# Altium schematic sheet SOCEthernetPHY.SchDoc
size A4; SheetNumber: 17; SheetTotal: 18
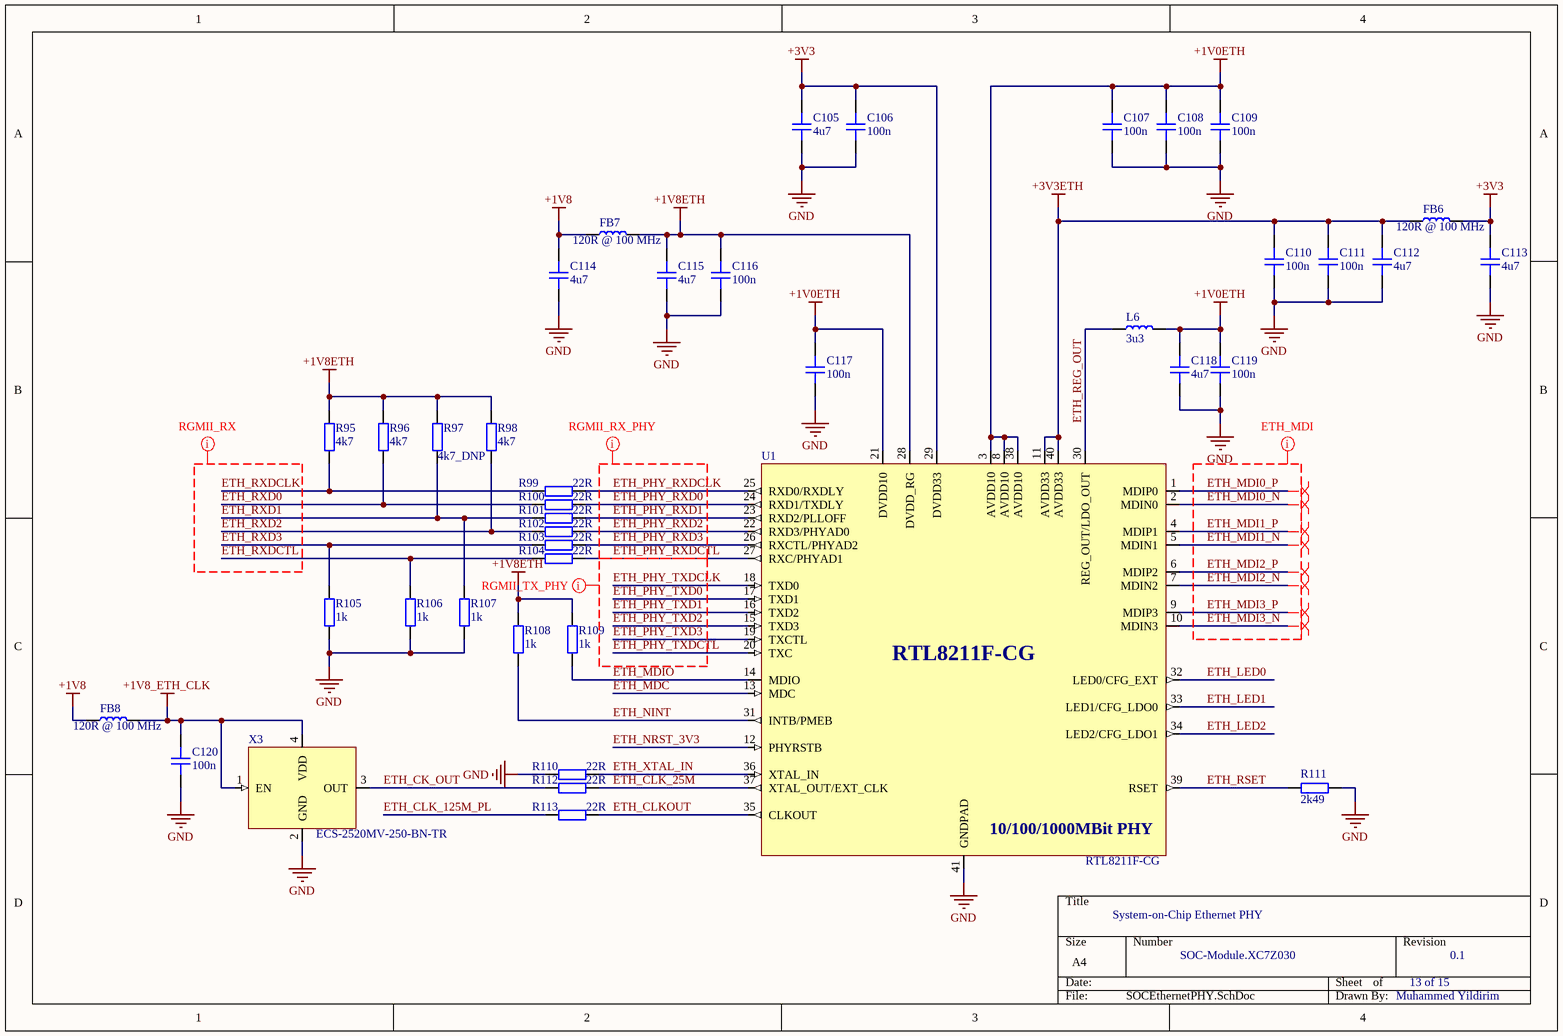
[diagram p0: SOCEthernetPHY.SchDoc]

## Parts
C105  4u7  [CAP_0402]
C106  100n  [CAP_0201]
C107  100n  [CAP_0201]
C108  100n  [CAP_0201]
C109  100n  [CAP_0201]
C110  100n  [CAP_0201]
C111  100n  [CAP_0201]
C112  4u7  [CAP_0402]
C113  4u7  [CAP_0402]
C114  4u7  [CAP_0402]
C115  4u7  [CAP_0402]
C116  100n  [CAP_0201]
C117  100n  [CAP_0201]
C118  4u7  [CAP_0402]
C119  100n  [CAP_0201]
C120  100n  [CAP_0201]
FB6  120R @ 100 MHz  [IND_0201]
FB7  120R @ 100 MHz  [IND_0201]
FB8  120R @ 100 MHz  [IND_0201]
L6  3u3  [IND_0402]
R95  4k7  [RES_0201]
R96  4k7  [RES_0201]
R97  4k7_DNP  [RES_0201]
R98  4k7  [RES_0201]
R99  22R  [RES_0201]
R100  22R  [RES_0201]
R101  22R  [RES_0201]
R102  22R  [RES_0201]
R103  22R  [RES_0201]
R104  22R  [RES_0201]
R105  1k  [RES_0201]
R106  1k  [RES_0201]
R107  1k  [RES_0201]
R108  1k  [RES_0201]
R109  1k  [RES_0201]
R110  22R  [RES_0201]
R111  2k49  [RES_0201]
R112  22R  [RES_0201]
R113  22R  [RES_0201]
U1  RTL8211F-CG  [QFN-40-0.4-EP]
X3  ECS-2520MV-250-BN-TR  [XTAL_2520]

## Nets
+1V0ETH: C107.2 C108.2 C109.2 C117.2 C118.2 C119.1 L6.2 U1.3(AVDD10) U1.8(AVDD10) U1.21(DVDD10) U1.38(AVDD10)
+1V8: C114.2 FB7.1 FB8.1
+1V8_ETH_CLK: C120.1 FB8.2 X3.1(EN) X3.4(VDD)
+1V8ETH: C115.2 C116.2 FB7.2 R95.1 R96.1 R97.1 R98.1 R108.1 R109.1 U1.28(DVDD_RG)
+3V3: C105.2 C106.2 C113.2 FB6.2 U1.29(DVDD33)
+3V3ETH: C110.1 C111.1 C112.2 FB6.1 U1.11(AVDD33) U1.40(AVDD33)
GND: C105.1 C106.1 C107.1 C108.1 C109.1 C110.2 C111.2 C112.1 C113.1 C114.1 C115.1 C116.1 C117.1 C118.1 C119.2 C120.2 R105.2 R106.2 R107.2 R110.1 R111.1 U1.41(GNDPAD) X3.2(GND)
ETH_CK_OUT: R112.1 X3.3(OUT)
ETH_CLK_25M: R112.2 U1.37(XTAL_OUT/EXT_CLK)
ETH_CLK_125M_PL: R113.1
ETH_CLKOUT: R113.2 U1.35(CLKOUT)
ETH_LED0: U1.32(LED0/CFG_EXT)
ETH_LED1: U1.33(LED1/CFG_LDO0)
ETH_LED2: U1.34(LED2/CFG_LDO1)
ETH_MDC: U1.13(MDC)
ETH_MDI0_N: U1.2(MDIN0)
ETH_MDI0_P: U1.1(MDIP0)
ETH_MDI1_N: U1.5(MDIN1)
ETH_MDI1_P: U1.4(MDIP1)
ETH_MDI2_N: U1.7(MDIN2)
ETH_MDI2_P: U1.6(MDIP2)
ETH_MDI3_N: U1.10(MDIN3)
ETH_MDI3_P: U1.9(MDIP3)
ETH_MDIO: R109.2 U1.14(MDIO)
ETH_NINT: R108.2 U1.31(INTB/PMEB)
ETH_NRST_3V3: U1.12(PHYRSTB)
ETH_PHY_RXD0: R100.1 U1.24(RXD1/TXDLY)
ETH_PHY_RXD1: R101.1 U1.23(RXD2/PLLOFF)
ETH_PHY_RXD2: R102.1 U1.22(RXD3/PHYAD0)
ETH_PHY_RXD3: R103.1 U1.26(RXCTL/PHYAD2)
ETH_PHY_RXDCLK: R99.1 U1.25(RXD0/RXDLY)
ETH_PHY_RXDCTL: R104.1 U1.27(RXC/PHYAD1)
ETH_PHY_TXD0: U1.17(TXD1)
ETH_PHY_TXD1: U1.16(TXD2)
ETH_PHY_TXD2: U1.15(TXD3)
ETH_PHY_TXD3: U1.19(TXCTL)
ETH_PHY_TXDCLK: U1.18(TXD0)
ETH_PHY_TXDCTL: U1.20(TXC)
ETH_REG_OUT: L6.1 U1.30(REG_OUT/LDO_OUT)
ETH_RSET: R111.2 U1.39(RSET)
ETH_RXD0: R96.2 R100.2
ETH_RXD1: R97.2 R101.2 R107.1
ETH_RXD2: R98.2 R102.2
ETH_RXD3: R103.2 R105.1
ETH_RXDCLK: R95.2 R99.2
ETH_RXDCTL: R104.2 R106.1
ETH_XTAL_IN: R110.2 U1.36(XTAL_IN)

## Layout directives
differential pair: ETH_MDI0_N, ETH_MDI0_P, ETH_MDI1_N, ETH_MDI1_P, ETH_MDI2_N, ETH_MDI2_P, ETH_MDI3_N, ETH_MDI3_P
mark named ETH_MDI: ETH_MDI0_N, ETH_MDI0_P, ETH_MDI1_N, ETH_MDI1_P, ETH_MDI2_N, ETH_MDI2_P, ETH_MDI3_N, ETH_MDI3_P
mark named RGMII_RX_PHY: ETH_PHY_RXD0, ETH_PHY_RXD1, ETH_PHY_RXD2, ETH_PHY_RXD3, ETH_PHY_RXDCLK, ETH_PHY_RXDCTL
mark named RGMII_RX: ETH_RXD0, ETH_RXD1, ETH_RXD2, ETH_RXD3, ETH_RXDCLK, ETH_RXDCTL
mark named RGMII_TX_PHY: ETH_PHY_RXDCTL, ETH_PHY_TXD0, ETH_PHY_TXD1, ETH_PHY_TXD2, ETH_PHY_TXD3, ETH_PHY_TXDCLK, ETH_PHY_TXDCTL

## Notes on the sheet
- System-on-Chip Ethernet PHY
- SOC-Module.XC7Z030
- 13 of 15
- 0.1
- Muhammed Yildirim
- (in symbol RTL8211F-CG) 10/100/1000MBit PHY

## Library data of the parts
C105 C112-C115 C118 = CAP_0402: Capacitor SMD 0402; Manufacturer: *; Manufacturer Part Number: *; Distributor Link: *; LCSC: *; Rating: *; Dielectric: *
C106-C111 C116 C117 C119 C120 = CAP_0201: Capacitor SMD 0201; Manufacturer: *; Manufacturer Part Number: *; Distributor Link: *; LCSC: *; Rating: *; Dielectric: *
FB6-FB8 = IND_0201: Inductor SMD 0201; Manufacturer_Name: Murata Electronics; Manufacturer_Part_Number: LQP03HQ56NH02D; Datasheet Link: https://psearch.en.murata.com/inductor/product/LQP03HQ56NH02%23.html; Height: 0.42mm; Mouser Part Number: 81-LQP03HQ56NH02D; Mouser Price/Stock: https://www.mouser.co.uk/ProductDetail/Murata-Electronics/LQP03HQ56NH02D?qs=B6kkDfuK7%2FBQu1Ob9%2FT2Bg%3D%3D
L6 = IND_0402: Inductor SMD 0402
R95-R113 = RES_0201: Resistor SMD 0201; Manufacturer: *; Manufacturer Part Number: *; Distributor Link: *; LCSC: *
U1 = RTL8211F-CG: INTEGRATED 10/100/1000M ETHERNET PRECISION TRANSCEIVER; Manufacturer: Realtek; Manufacturer Part Number: RTL8211F-CG
X3 = ECS-2520MV-130-BN-TR: Standard Clock Oscillators XO (Standard),13MHz,Standby (Power Down),CMOS, Multi-Volt,1.6 V 3.6 V,+/-50ppm,-40 C 85 C,6mA,Surface Mount,4-SMD, No Lead,(2.50mm x 2.00mm),(0.80mm); Manufacturer: ECS; Manufacturer Part Number: ECS-2520MV-130-BN-TR